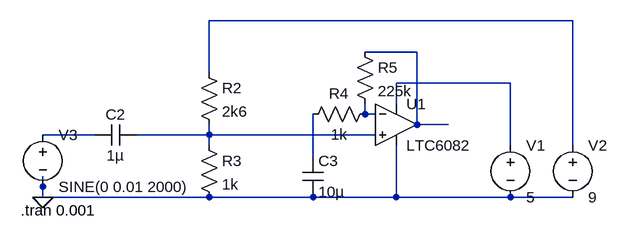
[diagram p0: schematic RXAmp.asc]
RXAmp.asc, the LTspice schematic file:
Version 4
SHEET 1 1208 680
WIRE 1152 -32 592 -32
WIRE 912 16 832 16
WIRE 592 48 592 -32
WIRE 1056 64 880 64
WIRE 880 96 880 64
WIRE 832 112 832 96
WIRE 848 112 832 112
WIRE 912 128 912 16
WIRE 960 128 912 128
WIRE 416 144 336 144
WIRE 592 144 592 128
WIRE 592 144 480 144
WIRE 848 144 592 144
WIRE 592 160 592 144
WIRE 1056 160 1056 64
WIRE 1152 160 1152 -32
WIRE 752 176 752 112
WIRE 336 224 336 208
WIRE 336 240 336 224
WIRE 592 240 336 240
WIRE 752 240 592 240
WIRE 880 240 880 160
WIRE 880 240 752 240
WIRE 1056 240 880 240
WIRE 1152 240 1056 240
FLAG 336 240 0
SYMBOL cap 480 128 R90
WINDOW 0 0 32 VBottom 2
WINDOW 3 32 32 VTop 2
SYMATTR InstName C2
SYMATTR Value 1µ
SYMBOL res 576 32 R0
SYMATTR InstName R2
SYMATTR Value 2k6
SYMBOL res 576 144 R0
SYMATTR InstName R3
SYMATTR Value 1k
SYMBOL OpAmps\\LTC6082 880 128 R0
SYMATTR InstName U1
SYMBOL cap 736 176 R0
SYMATTR InstName C3
SYMATTR Value 10µ
SYMBOL res 848 96 R90
WINDOW 0 0 56 VBottom 2
WINDOW 3 32 56 VTop 2
SYMATTR InstName R4
SYMATTR Value 1k
SYMBOL res 816 0 R0
SYMATTR InstName R5
SYMATTR Value 225k
SYMBOL voltage 1056 144 R0
WINDOW 123 0 0 Left 0
WINDOW 39 0 0 Left 0
SYMATTR InstName V1
SYMATTR Value 5
SYMBOL voltage 1152 144 R0
WINDOW 123 0 0 Left 0
WINDOW 39 0 0 Left 0
SYMATTR InstName V2
SYMATTR Value 9
SYMBOL voltage 336 128 R0
WINDOW 123 0 0 Left 0
WINDOW 39 0 0 Left 0
SYMATTR InstName V3
SYMATTR Value SINE(0 0.01 2000)
TEXT 302 260 Left 2 !.tran 0.001

The netlist it stands for:
* RXAmp.asc
C2 N006 N005 1µ
R2 N001 N006 2k6
R3 N006 0 1k
* U1: LTC6082 (symbol OpAmps\LTC6082 not available, pins judged from their places): In+=N006 In-=N004 V+=N003 V-=0 OUT=N002
C3 N007 0 10µ
R4 N004 N007 1k
R5 N002 N004 225k
V1 N003 0 5
V2 N001 0 9
V3 N005 0 SINE(0 0.01 2000)
.tran 0.001
.backanno
.end